# Vivado block design Uart_ETH, xc7z020clg400-1, Vivado 2017.2
# (continued, part 2 of 6)
current_bd_instance /Uart_Blocks/Uart_9
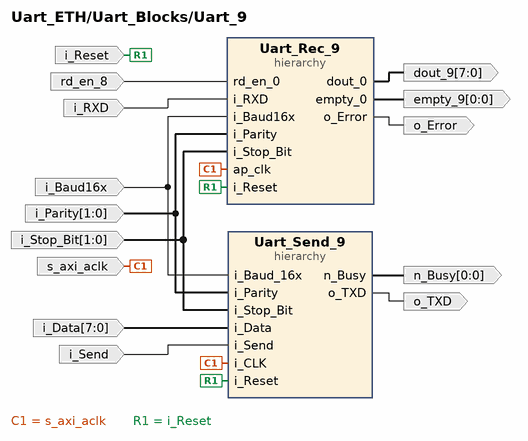
[diagram p24: block diagram inside /Uart_Blocks/Uart_9]
create_bd_pin -dir I -type clk s_axi_aclk
create_bd_pin -dir I i_RXD
create_bd_pin -dir I -type rst i_Reset
create_bd_pin -dir O -from 7 -to 0 dout_9
create_bd_pin -dir O -from 0 -to 0 empty_9
create_bd_pin -dir I rd_en_8
create_bd_pin -dir I -from 7 -to 0 i_Data
create_bd_pin -dir I i_Send
create_bd_pin -dir O -from 0 -to 0 n_Busy
create_bd_pin -dir O o_TXD
create_bd_pin -dir I i_Baud16x
create_bd_pin -dir I -from 1 -to 0 i_Parity
create_bd_pin -dir I -from 1 -to 0 i_Stop_Bit
create_bd_pin -dir O o_Error

create_bd_cell -type hier Uart_Rec_9
create_bd_cell -type hier Uart_Send_9

# ---- hierarchy /Uart_Blocks/Uart_9/Uart_Rec_9 ----
current_bd_instance /Uart_Blocks/Uart_9/Uart_Rec_9
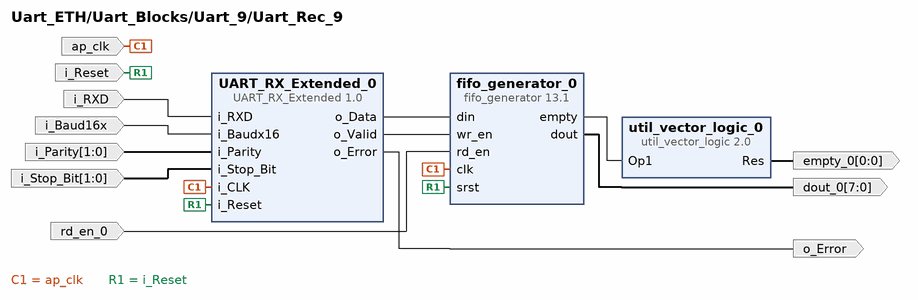
[diagram p25: block diagram inside /Uart_Blocks/Uart_9/Uart_Rec_9]
create_bd_pin -dir I -type clk ap_clk
create_bd_pin -dir I i_RXD
create_bd_pin -dir I -type rst i_Reset
create_bd_pin -dir O -from 7 -to 0 dout_0
create_bd_pin -dir I rd_en_0
create_bd_pin -dir O -from 0 -to 0 empty_0
create_bd_pin -dir I i_Baud16x
create_bd_pin -dir I -from 1 -to 0 i_Parity
create_bd_pin -dir I -from 1 -to 0 i_Stop_Bit
create_bd_pin -dir O o_Error

create_bd_cell -type ip -vlnv xilinx.com:ip:util_vector_logic:2.0 util_vector_logic_0
set_property -dict {CONFIG.C_SIZE 1 CONFIG.C_OPERATION not} [get_bd_cells util_vector_logic_0]
create_bd_cell -type ip -vlnv xilinx.com:ip:fifo_generator:13.1 fifo_generator_0
set_property -dict [list \
  CONFIG.Performance_Options First_Word_Fall_Through \
  CONFIG.Input_Data_Width 8 \
  CONFIG.Input_Depth 256 \
  CONFIG.Output_Data_Width 8 \
  CONFIG.Data_Count true \
  CONFIG.Data_Count_Width 9 \
] [get_bd_cells fifo_generator_0]
create_bd_cell -type ip -vlnv xilinx.com:user:UART_RX_Extended:1.0 UART_RX_Extended_0

# ---- hierarchy /Uart_Blocks/Uart_9/Uart_Send_9 ----
current_bd_instance /Uart_Blocks/Uart_9/Uart_Send_9
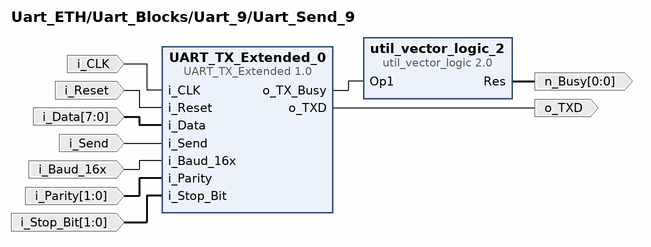
[diagram p26: block diagram inside /Uart_Blocks/Uart_9/Uart_Send_9]
create_bd_pin -dir O -from 0 -to 0 n_Busy
create_bd_pin -dir I -type clk i_CLK
create_bd_pin -dir I -type rst i_Reset
create_bd_pin -dir I -from 7 -to 0 i_Data
create_bd_pin -dir I i_Send
create_bd_pin -dir O o_TXD
create_bd_pin -dir I i_Baud_16x
create_bd_pin -dir I -from 1 -to 0 i_Parity
create_bd_pin -dir I -from 1 -to 0 i_Stop_Bit

create_bd_cell -type ip -vlnv xilinx.com:ip:util_vector_logic:2.0 util_vector_logic_2
set_property -dict {CONFIG.C_SIZE 1 CONFIG.C_OPERATION not} [get_bd_cells util_vector_logic_2]
create_bd_cell -type ip -vlnv xilinx.com:user:UART_TX_Extended:1.0 UART_TX_Extended_0

# ---- hierarchy /Uart_Blocks/Uart_10 ----
current_bd_instance /Uart_Blocks/Uart_10
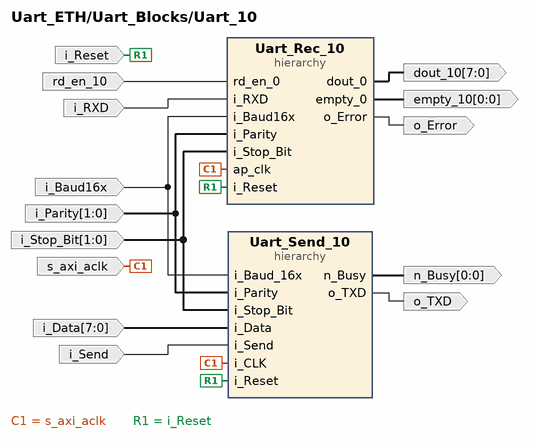
[diagram p27: block diagram inside /Uart_Blocks/Uart_10]
create_bd_pin -dir I -type clk s_axi_aclk
create_bd_pin -dir I i_RXD
create_bd_pin -dir I -type rst i_Reset
create_bd_pin -dir O -from 7 -to 0 dout_10
create_bd_pin -dir O -from 0 -to 0 empty_10
create_bd_pin -dir I rd_en_10
create_bd_pin -dir I -from 7 -to 0 i_Data
create_bd_pin -dir I i_Send
create_bd_pin -dir O -from 0 -to 0 n_Busy
create_bd_pin -dir O o_TXD
create_bd_pin -dir I i_Baud16x
create_bd_pin -dir I -from 1 -to 0 i_Parity
create_bd_pin -dir I -from 1 -to 0 i_Stop_Bit
create_bd_pin -dir O o_Error

create_bd_cell -type hier Uart_Rec_10
create_bd_cell -type hier Uart_Send_10

# ---- hierarchy /Uart_Blocks/Uart_10/Uart_Rec_10 ----
current_bd_instance /Uart_Blocks/Uart_10/Uart_Rec_10
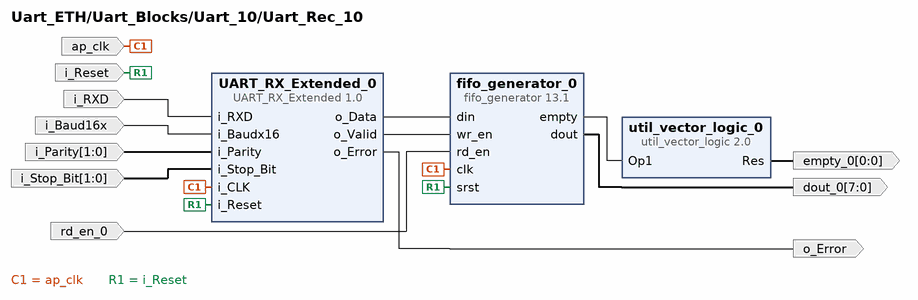
[diagram p28: block diagram inside /Uart_Blocks/Uart_10/Uart_Rec_10]
create_bd_pin -dir I -type clk ap_clk
create_bd_pin -dir I i_RXD
create_bd_pin -dir I -type rst i_Reset
create_bd_pin -dir O -from 7 -to 0 dout_0
create_bd_pin -dir I rd_en_0
create_bd_pin -dir O -from 0 -to 0 empty_0
create_bd_pin -dir I i_Baud16x
create_bd_pin -dir I -from 1 -to 0 i_Parity
create_bd_pin -dir I -from 1 -to 0 i_Stop_Bit
create_bd_pin -dir O o_Error

create_bd_cell -type ip -vlnv xilinx.com:ip:util_vector_logic:2.0 util_vector_logic_0
set_property -dict {CONFIG.C_SIZE 1 CONFIG.C_OPERATION not} [get_bd_cells util_vector_logic_0]
create_bd_cell -type ip -vlnv xilinx.com:ip:fifo_generator:13.1 fifo_generator_0
set_property -dict [list \
  CONFIG.Performance_Options First_Word_Fall_Through \
  CONFIG.Input_Data_Width 8 \
  CONFIG.Input_Depth 256 \
  CONFIG.Output_Data_Width 8 \
  CONFIG.Data_Count true \
  CONFIG.Data_Count_Width 9 \
] [get_bd_cells fifo_generator_0]
create_bd_cell -type ip -vlnv xilinx.com:user:UART_RX_Extended:1.0 UART_RX_Extended_0

# ---- hierarchy /Uart_Blocks/Uart_10/Uart_Send_10 ----
current_bd_instance /Uart_Blocks/Uart_10/Uart_Send_10
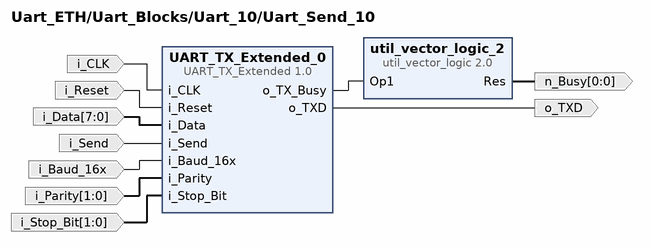
[diagram p29: block diagram inside /Uart_Blocks/Uart_10/Uart_Send_10]
create_bd_pin -dir O -from 0 -to 0 n_Busy
create_bd_pin -dir I -type clk i_CLK
create_bd_pin -dir I -type rst i_Reset
create_bd_pin -dir I -from 7 -to 0 i_Data
create_bd_pin -dir I i_Send
create_bd_pin -dir O o_TXD
create_bd_pin -dir I i_Baud_16x
create_bd_pin -dir I -from 1 -to 0 i_Parity
create_bd_pin -dir I -from 1 -to 0 i_Stop_Bit

create_bd_cell -type ip -vlnv xilinx.com:ip:util_vector_logic:2.0 util_vector_logic_2
set_property -dict {CONFIG.C_SIZE 1 CONFIG.C_OPERATION not} [get_bd_cells util_vector_logic_2]
create_bd_cell -type ip -vlnv xilinx.com:user:UART_TX_Extended:1.0 UART_TX_Extended_0

# ---- hierarchy /Uart_Blocks/Uart_11 ----
current_bd_instance /Uart_Blocks/Uart_11
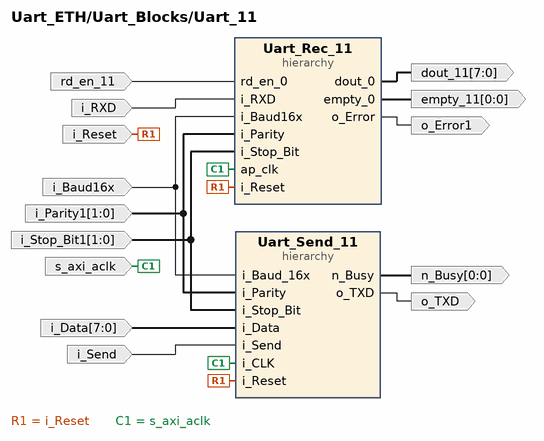
[diagram p30: block diagram inside /Uart_Blocks/Uart_11]
create_bd_pin -dir I i_RXD
create_bd_pin -dir I -type clk s_axi_aclk
create_bd_pin -dir I -type rst i_Reset
create_bd_pin -dir O -from 0 -to 0 empty_11
create_bd_pin -dir I rd_en_11
create_bd_pin -dir I i_Baud16x
create_bd_pin -dir O -from 0 -to 0 n_Busy
create_bd_pin -dir I -from 7 -to 0 i_Data
create_bd_pin -dir O o_TXD
create_bd_pin -dir I i_Send
create_bd_pin -dir O -from 7 -to 0 dout_11
create_bd_pin -dir I -from 1 -to 0 i_Parity1
create_bd_pin -dir I -from 1 -to 0 i_Stop_Bit1
create_bd_pin -dir O o_Error1

create_bd_cell -type hier Uart_Rec_11
create_bd_cell -type hier Uart_Send_11

# ---- hierarchy /Uart_Blocks/Uart_11/Uart_Rec_11 ----
current_bd_instance /Uart_Blocks/Uart_11/Uart_Rec_11
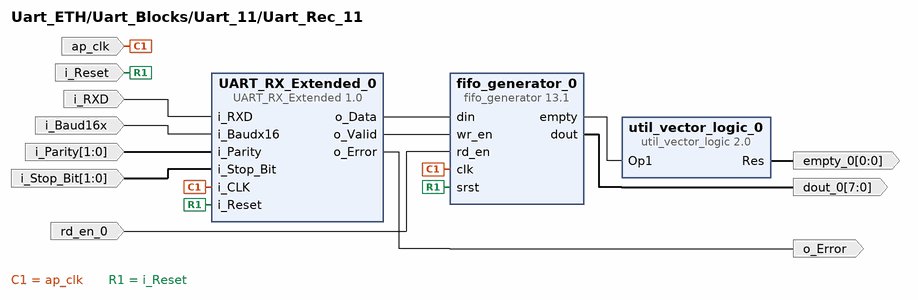
[diagram p31: block diagram inside /Uart_Blocks/Uart_11/Uart_Rec_11]
create_bd_pin -dir I -type clk ap_clk
create_bd_pin -dir I i_RXD
create_bd_pin -dir I -type rst i_Reset
create_bd_pin -dir O -from 7 -to 0 dout_0
create_bd_pin -dir I rd_en_0
create_bd_pin -dir O -from 0 -to 0 empty_0
create_bd_pin -dir I i_Baud16x
create_bd_pin -dir I -from 1 -to 0 i_Parity
create_bd_pin -dir I -from 1 -to 0 i_Stop_Bit
create_bd_pin -dir O o_Error

create_bd_cell -type ip -vlnv xilinx.com:ip:util_vector_logic:2.0 util_vector_logic_0
set_property -dict {CONFIG.C_SIZE 1 CONFIG.C_OPERATION not} [get_bd_cells util_vector_logic_0]
create_bd_cell -type ip -vlnv xilinx.com:ip:fifo_generator:13.1 fifo_generator_0
set_property -dict [list \
  CONFIG.Performance_Options First_Word_Fall_Through \
  CONFIG.Input_Data_Width 8 \
  CONFIG.Input_Depth 256 \
  CONFIG.Output_Data_Width 8 \
  CONFIG.Data_Count true \
  CONFIG.Data_Count_Width 9 \
] [get_bd_cells fifo_generator_0]
create_bd_cell -type ip -vlnv xilinx.com:user:UART_RX_Extended:1.0 UART_RX_Extended_0

# ---- hierarchy /Uart_Blocks/Uart_11/Uart_Send_11 ----
current_bd_instance /Uart_Blocks/Uart_11/Uart_Send_11
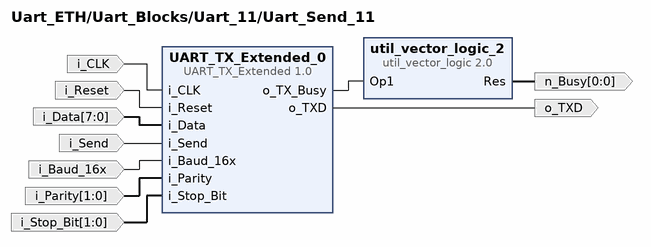
[diagram p32: block diagram inside /Uart_Blocks/Uart_11/Uart_Send_11]
create_bd_pin -dir O -from 0 -to 0 n_Busy
create_bd_pin -dir I -type clk i_CLK
create_bd_pin -dir I -type rst i_Reset
create_bd_pin -dir I -from 7 -to 0 i_Data
create_bd_pin -dir I i_Send
create_bd_pin -dir O o_TXD
create_bd_pin -dir I i_Baud_16x
create_bd_pin -dir I -from 1 -to 0 i_Parity
create_bd_pin -dir I -from 1 -to 0 i_Stop_Bit

create_bd_cell -type ip -vlnv xilinx.com:ip:util_vector_logic:2.0 util_vector_logic_2
set_property -dict {CONFIG.C_SIZE 1 CONFIG.C_OPERATION not} [get_bd_cells util_vector_logic_2]
create_bd_cell -type ip -vlnv xilinx.com:user:UART_TX_Extended:1.0 UART_TX_Extended_0

# ---- hierarchy /Uart_Blocks/Uart_12 ----
current_bd_instance /Uart_Blocks/Uart_12
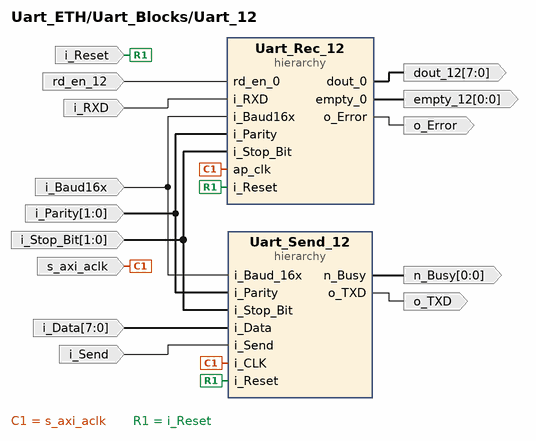
[diagram p33: block diagram inside /Uart_Blocks/Uart_12]
create_bd_pin -dir I -type clk s_axi_aclk
create_bd_pin -dir I i_RXD
create_bd_pin -dir I -type rst i_Reset
create_bd_pin -dir O -from 7 -to 0 dout_12
create_bd_pin -dir O -from 0 -to 0 empty_12
create_bd_pin -dir I rd_en_12
create_bd_pin -dir I -from 7 -to 0 i_Data
create_bd_pin -dir I i_Send
create_bd_pin -dir O -from 0 -to 0 n_Busy
create_bd_pin -dir O o_TXD
create_bd_pin -dir I i_Baud16x
create_bd_pin -dir I -from 1 -to 0 i_Parity
create_bd_pin -dir I -from 1 -to 0 i_Stop_Bit
create_bd_pin -dir O o_Error

create_bd_cell -type hier Uart_Rec_12
create_bd_cell -type hier Uart_Send_12

# ---- hierarchy /Uart_Blocks/Uart_12/Uart_Rec_12 ----
current_bd_instance /Uart_Blocks/Uart_12/Uart_Rec_12
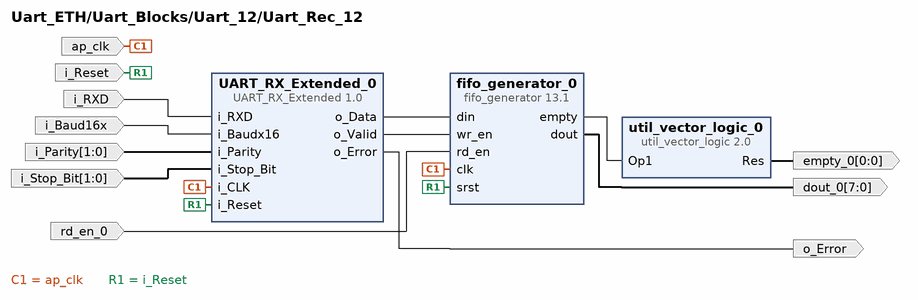
[diagram p34: block diagram inside /Uart_Blocks/Uart_12/Uart_Rec_12]
create_bd_pin -dir I -type clk ap_clk
create_bd_pin -dir I i_RXD
create_bd_pin -dir I -type rst i_Reset
create_bd_pin -dir O -from 7 -to 0 dout_0
create_bd_pin -dir I rd_en_0
create_bd_pin -dir O -from 0 -to 0 empty_0
create_bd_pin -dir I i_Baud16x
create_bd_pin -dir I -from 1 -to 0 i_Parity
create_bd_pin -dir I -from 1 -to 0 i_Stop_Bit
create_bd_pin -dir O o_Error

create_bd_cell -type ip -vlnv xilinx.com:ip:util_vector_logic:2.0 util_vector_logic_0
set_property -dict {CONFIG.C_SIZE 1 CONFIG.C_OPERATION not} [get_bd_cells util_vector_logic_0]
create_bd_cell -type ip -vlnv xilinx.com:ip:fifo_generator:13.1 fifo_generator_0
set_property -dict [list \
  CONFIG.Performance_Options First_Word_Fall_Through \
  CONFIG.Input_Data_Width 8 \
  CONFIG.Input_Depth 256 \
  CONFIG.Output_Data_Width 8 \
  CONFIG.Data_Count true \
  CONFIG.Data_Count_Width 9 \
] [get_bd_cells fifo_generator_0]
create_bd_cell -type ip -vlnv xilinx.com:user:UART_RX_Extended:1.0 UART_RX_Extended_0

# ---- hierarchy /Uart_Blocks/Uart_12/Uart_Send_12 ----
current_bd_instance /Uart_Blocks/Uart_12/Uart_Send_12
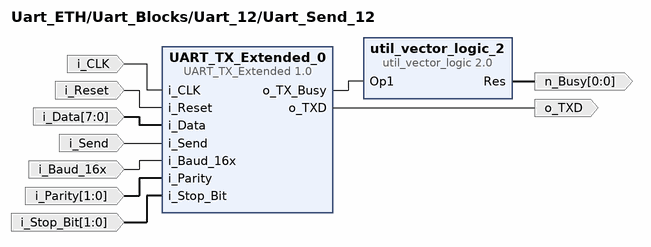
[diagram p35: block diagram inside /Uart_Blocks/Uart_12/Uart_Send_12]
create_bd_pin -dir O -from 0 -to 0 n_Busy
create_bd_pin -dir I -type clk i_CLK
create_bd_pin -dir I -type rst i_Reset
create_bd_pin -dir I -from 7 -to 0 i_Data
create_bd_pin -dir I i_Send
create_bd_pin -dir O o_TXD
create_bd_pin -dir I i_Baud_16x
create_bd_pin -dir I -from 1 -to 0 i_Parity
create_bd_pin -dir I -from 1 -to 0 i_Stop_Bit

create_bd_cell -type ip -vlnv xilinx.com:ip:util_vector_logic:2.0 util_vector_logic_2
set_property -dict {CONFIG.C_SIZE 1 CONFIG.C_OPERATION not} [get_bd_cells util_vector_logic_2]
create_bd_cell -type ip -vlnv xilinx.com:user:UART_TX_Extended:1.0 UART_TX_Extended_0

# ---- hierarchy /Uart_Blocks/Uart_13 ----
current_bd_instance /Uart_Blocks/Uart_13
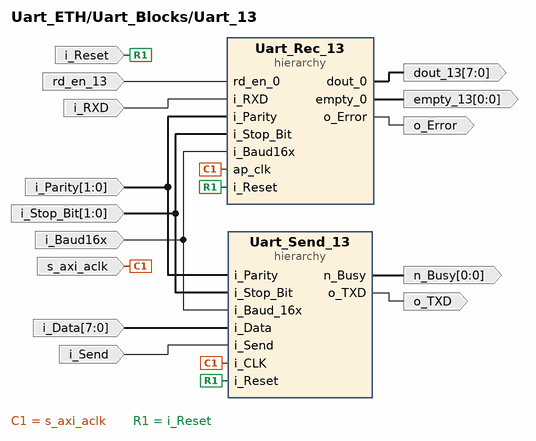
[diagram p36: block diagram inside /Uart_Blocks/Uart_13]
create_bd_pin -dir I -type clk s_axi_aclk
create_bd_pin -dir I i_RXD
create_bd_pin -dir I -type rst i_Reset
create_bd_pin -dir O -from 7 -to 0 dout_13
create_bd_pin -dir O -from 0 -to 0 empty_13
create_bd_pin -dir I rd_en_13
create_bd_pin -dir I -from 7 -to 0 i_Data
create_bd_pin -dir I i_Send
create_bd_pin -dir O -from 0 -to 0 n_Busy
create_bd_pin -dir O o_TXD
create_bd_pin -dir I i_Baud16x
create_bd_pin -dir I -from 1 -to 0 i_Parity
create_bd_pin -dir I -from 1 -to 0 i_Stop_Bit
create_bd_pin -dir O o_Error

create_bd_cell -type hier Uart_Rec_13
create_bd_cell -type hier Uart_Send_13

# ---- hierarchy /Uart_Blocks/Uart_13/Uart_Rec_13 ----
current_bd_instance /Uart_Blocks/Uart_13/Uart_Rec_13
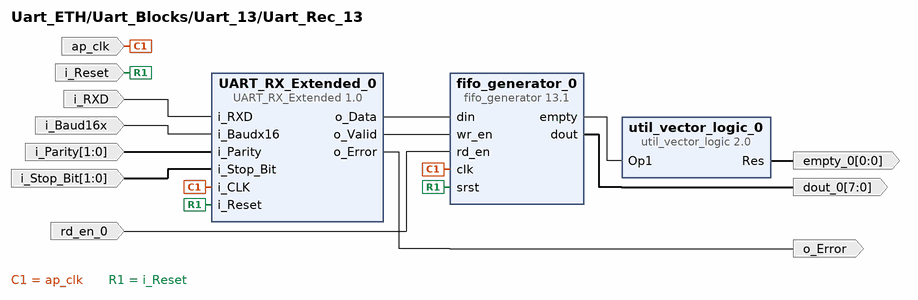
[diagram p37: block diagram inside /Uart_Blocks/Uart_13/Uart_Rec_13]
create_bd_pin -dir I -type clk ap_clk
create_bd_pin -dir I i_RXD
create_bd_pin -dir I -type rst i_Reset
create_bd_pin -dir O -from 7 -to 0 dout_0
create_bd_pin -dir I rd_en_0
create_bd_pin -dir O -from 0 -to 0 empty_0
create_bd_pin -dir I i_Baud16x
create_bd_pin -dir I -from 1 -to 0 i_Parity
create_bd_pin -dir I -from 1 -to 0 i_Stop_Bit
create_bd_pin -dir O o_Error

create_bd_cell -type ip -vlnv xilinx.com:ip:util_vector_logic:2.0 util_vector_logic_0
set_property -dict {CONFIG.C_SIZE 1 CONFIG.C_OPERATION not} [get_bd_cells util_vector_logic_0]
create_bd_cell -type ip -vlnv xilinx.com:ip:fifo_generator:13.1 fifo_generator_0
set_property -dict [list \
  CONFIG.Performance_Options First_Word_Fall_Through \
  CONFIG.Input_Data_Width 8 \
  CONFIG.Input_Depth 256 \
  CONFIG.Output_Data_Width 8 \
  CONFIG.Data_Count true \
  CONFIG.Data_Count_Width 9 \
] [get_bd_cells fifo_generator_0]
create_bd_cell -type ip -vlnv xilinx.com:user:UART_RX_Extended:1.0 UART_RX_Extended_0

# ---- hierarchy /Uart_Blocks/Uart_13/Uart_Send_13 ----
current_bd_instance /Uart_Blocks/Uart_13/Uart_Send_13
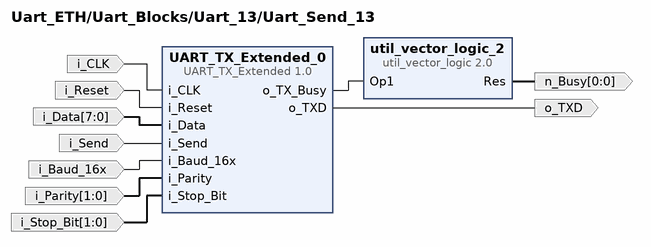
[diagram p38: block diagram inside /Uart_Blocks/Uart_13/Uart_Send_13]
create_bd_pin -dir O -from 0 -to 0 n_Busy
create_bd_pin -dir I -type clk i_CLK
create_bd_pin -dir I -type rst i_Reset
create_bd_pin -dir I -from 7 -to 0 i_Data
create_bd_pin -dir I i_Send
create_bd_pin -dir O o_TXD
create_bd_pin -dir I i_Baud_16x
create_bd_pin -dir I -from 1 -to 0 i_Parity
create_bd_pin -dir I -from 1 -to 0 i_Stop_Bit

create_bd_cell -type ip -vlnv xilinx.com:ip:util_vector_logic:2.0 util_vector_logic_2
set_property -dict {CONFIG.C_SIZE 1 CONFIG.C_OPERATION not} [get_bd_cells util_vector_logic_2]
create_bd_cell -type ip -vlnv xilinx.com:user:UART_TX_Extended:1.0 UART_TX_Extended_0

# ---- hierarchy /Uart_Blocks/Uart_14 ----
current_bd_instance /Uart_Blocks/Uart_14
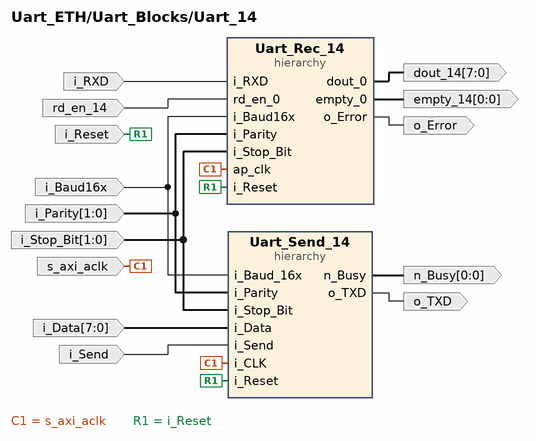
[diagram p39: block diagram inside /Uart_Blocks/Uart_14]
create_bd_pin -dir I -type clk s_axi_aclk
create_bd_pin -dir I i_RXD
create_bd_pin -dir I -type rst i_Reset
create_bd_pin -dir O -from 7 -to 0 dout_14
create_bd_pin -dir O -from 0 -to 0 empty_14
create_bd_pin -dir I rd_en_14
create_bd_pin -dir I -from 7 -to 0 i_Data
create_bd_pin -dir I i_Send
create_bd_pin -dir O -from 0 -to 0 n_Busy
create_bd_pin -dir O o_TXD
create_bd_pin -dir I i_Baud16x
create_bd_pin -dir I -from 1 -to 0 i_Parity
create_bd_pin -dir I -from 1 -to 0 i_Stop_Bit
create_bd_pin -dir O o_Error

create_bd_cell -type hier Uart_Rec_14
create_bd_cell -type hier Uart_Send_14

# ---- hierarchy /Uart_Blocks/Uart_14/Uart_Rec_14 ----
current_bd_instance /Uart_Blocks/Uart_14/Uart_Rec_14
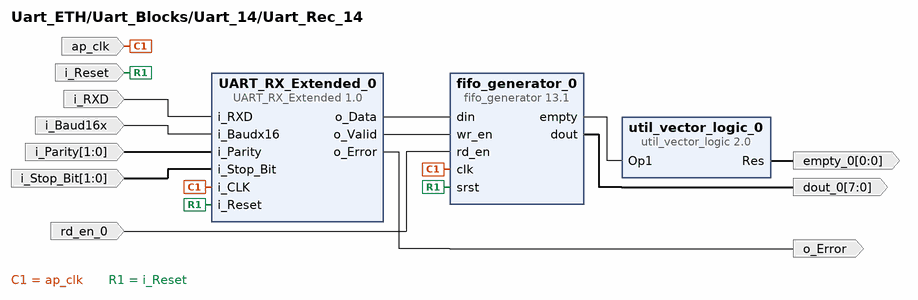
[diagram p40: block diagram inside /Uart_Blocks/Uart_14/Uart_Rec_14]
create_bd_pin -dir I -type clk ap_clk
create_bd_pin -dir I i_RXD
create_bd_pin -dir I -type rst i_Reset
create_bd_pin -dir O -from 7 -to 0 dout_0
create_bd_pin -dir I rd_en_0
create_bd_pin -dir O -from 0 -to 0 empty_0
create_bd_pin -dir I i_Baud16x
create_bd_pin -dir I -from 1 -to 0 i_Parity
create_bd_pin -dir I -from 1 -to 0 i_Stop_Bit
create_bd_pin -dir O o_Error

create_bd_cell -type ip -vlnv xilinx.com:ip:util_vector_logic:2.0 util_vector_logic_0
set_property -dict {CONFIG.C_SIZE 1 CONFIG.C_OPERATION not} [get_bd_cells util_vector_logic_0]
create_bd_cell -type ip -vlnv xilinx.com:ip:fifo_generator:13.1 fifo_generator_0
set_property -dict [list \
  CONFIG.Performance_Options First_Word_Fall_Through \
  CONFIG.Input_Data_Width 8 \
  CONFIG.Input_Depth 256 \
  CONFIG.Output_Data_Width 8 \
  CONFIG.Data_Count true \
  CONFIG.Data_Count_Width 9 \
] [get_bd_cells fifo_generator_0]
create_bd_cell -type ip -vlnv xilinx.com:user:UART_RX_Extended:1.0 UART_RX_Extended_0

# ---- hierarchy /Uart_Blocks/Uart_14/Uart_Send_14 ----
current_bd_instance /Uart_Blocks/Uart_14/Uart_Send_14
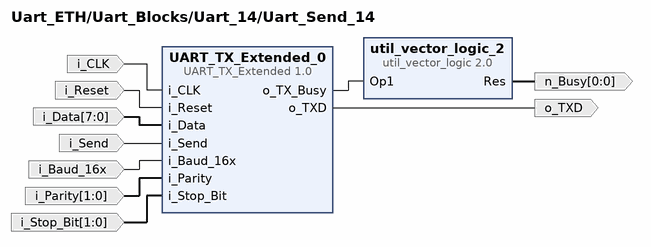
[diagram p41: block diagram inside /Uart_Blocks/Uart_14/Uart_Send_14]
create_bd_pin -dir O -from 0 -to 0 n_Busy
create_bd_pin -dir I -type clk i_CLK
create_bd_pin -dir I -type rst i_Reset
create_bd_pin -dir I -from 7 -to 0 i_Data
create_bd_pin -dir I i_Send
create_bd_pin -dir O o_TXD
create_bd_pin -dir I i_Baud_16x
create_bd_pin -dir I -from 1 -to 0 i_Parity
create_bd_pin -dir I -from 1 -to 0 i_Stop_Bit

create_bd_cell -type ip -vlnv xilinx.com:ip:util_vector_logic:2.0 util_vector_logic_2
set_property -dict {CONFIG.C_SIZE 1 CONFIG.C_OPERATION not} [get_bd_cells util_vector_logic_2]
create_bd_cell -type ip -vlnv xilinx.com:user:UART_TX_Extended:1.0 UART_TX_Extended_0

# ---- hierarchy /Uart_Blocks/Uart_15 ----
current_bd_instance /Uart_Blocks/Uart_15
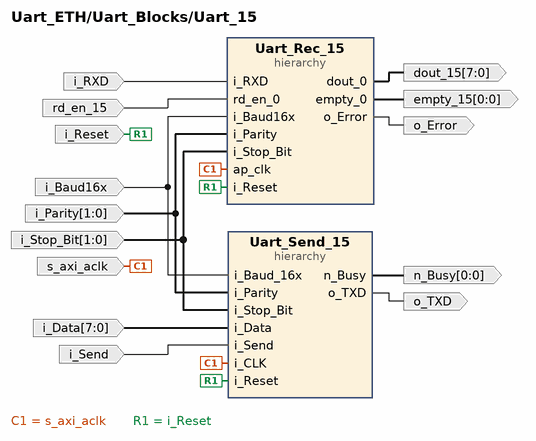
[diagram p42: block diagram inside /Uart_Blocks/Uart_15]
create_bd_pin -dir I -type clk s_axi_aclk
create_bd_pin -dir I i_RXD
create_bd_pin -dir I -type rst i_Reset
create_bd_pin -dir O -from 7 -to 0 dout_15
create_bd_pin -dir O -from 0 -to 0 empty_15
create_bd_pin -dir I rd_en_15
create_bd_pin -dir I -from 7 -to 0 i_Data
create_bd_pin -dir I i_Send
create_bd_pin -dir O -from 0 -to 0 n_Busy
create_bd_pin -dir O o_TXD
create_bd_pin -dir I i_Baud16x
create_bd_pin -dir I -from 1 -to 0 i_Parity
create_bd_pin -dir I -from 1 -to 0 i_Stop_Bit
create_bd_pin -dir O o_Error

create_bd_cell -type hier Uart_Rec_15
create_bd_cell -type hier Uart_Send_15

# ---- hierarchy /Uart_Blocks/Uart_15/Uart_Rec_15 ----
current_bd_instance /Uart_Blocks/Uart_15/Uart_Rec_15
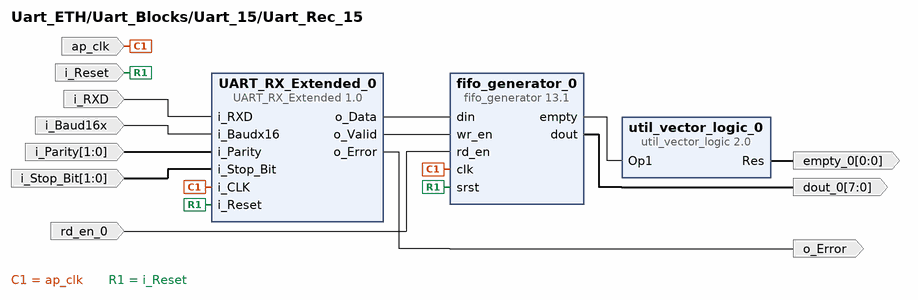
[diagram p43: block diagram inside /Uart_Blocks/Uart_15/Uart_Rec_15]
create_bd_pin -dir I -type clk ap_clk
create_bd_pin -dir I i_RXD
create_bd_pin -dir I -type rst i_Reset
create_bd_pin -dir O -from 7 -to 0 dout_0
create_bd_pin -dir I rd_en_0
create_bd_pin -dir O -from 0 -to 0 empty_0
create_bd_pin -dir I i_Baud16x
create_bd_pin -dir I -from 1 -to 0 i_Parity
create_bd_pin -dir I -from 1 -to 0 i_Stop_Bit
create_bd_pin -dir O o_Error

create_bd_cell -type ip -vlnv xilinx.com:ip:util_vector_logic:2.0 util_vector_logic_0
set_property -dict {CONFIG.C_SIZE 1 CONFIG.C_OPERATION not} [get_bd_cells util_vector_logic_0]
create_bd_cell -type ip -vlnv xilinx.com:ip:fifo_generator:13.1 fifo_generator_0
set_property -dict [list \
  CONFIG.Performance_Options First_Word_Fall_Through \
  CONFIG.Input_Data_Width 8 \
  CONFIG.Input_Depth 256 \
  CONFIG.Output_Data_Width 8 \
  CONFIG.Data_Count true \
  CONFIG.Data_Count_Width 9 \
] [get_bd_cells fifo_generator_0]
create_bd_cell -type ip -vlnv xilinx.com:user:UART_RX_Extended:1.0 UART_RX_Extended_0

# ---- hierarchy /Uart_Blocks/Uart_15/Uart_Send_15 ----
current_bd_instance /Uart_Blocks/Uart_15/Uart_Send_15
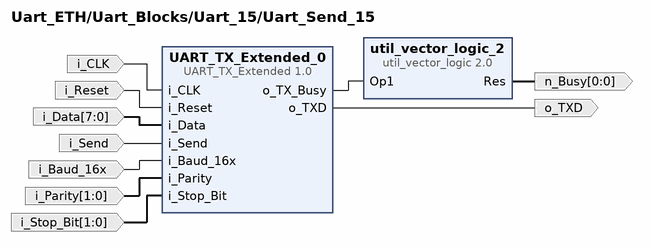
[diagram p44: block diagram inside /Uart_Blocks/Uart_15/Uart_Send_15]
create_bd_pin -dir O -from 0 -to 0 n_Busy
create_bd_pin -dir I -type clk i_CLK
create_bd_pin -dir I -type rst i_Reset
create_bd_pin -dir I -from 7 -to 0 i_Data
create_bd_pin -dir I i_Send
create_bd_pin -dir O o_TXD
create_bd_pin -dir I i_Baud_16x
create_bd_pin -dir I -from 1 -to 0 i_Parity
create_bd_pin -dir I -from 1 -to 0 i_Stop_Bit

create_bd_cell -type ip -vlnv xilinx.com:ip:util_vector_logic:2.0 util_vector_logic_2
set_property -dict {CONFIG.C_SIZE 1 CONFIG.C_OPERATION not} [get_bd_cells util_vector_logic_2]
create_bd_cell -type ip -vlnv xilinx.com:user:UART_TX_Extended:1.0 UART_TX_Extended_0

# ---- hierarchy /Uart_Blocks/Uart_0 ----
current_bd_instance /Uart_Blocks/Uart_0
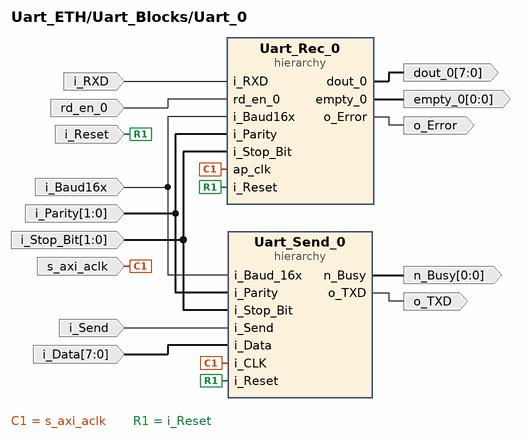
[diagram p45: block diagram inside /Uart_Blocks/Uart_0]
create_bd_pin -dir I -type clk s_axi_aclk
create_bd_pin -dir I i_RXD
create_bd_pin -dir I -type rst i_Reset
create_bd_pin -dir O -from 7 -to 0 dout_0
create_bd_pin -dir I rd_en_0
create_bd_pin -dir O -from 0 -to 0 empty_0
create_bd_pin -dir I i_Send
create_bd_pin -dir O -from 0 -to 0 n_Busy
create_bd_pin -dir I -from 7 -to 0 i_Data
create_bd_pin -dir O o_TXD
create_bd_pin -dir I i_Baud16x
create_bd_pin -dir I -from 1 -to 0 i_Parity
create_bd_pin -dir I -from 1 -to 0 i_Stop_Bit
create_bd_pin -dir O o_Error

create_bd_cell -type hier Uart_Rec_0
create_bd_cell -type hier Uart_Send_0

# ---- hierarchy /Uart_Blocks/Uart_0/Uart_Rec_0 ----
current_bd_instance /Uart_Blocks/Uart_0/Uart_Rec_0
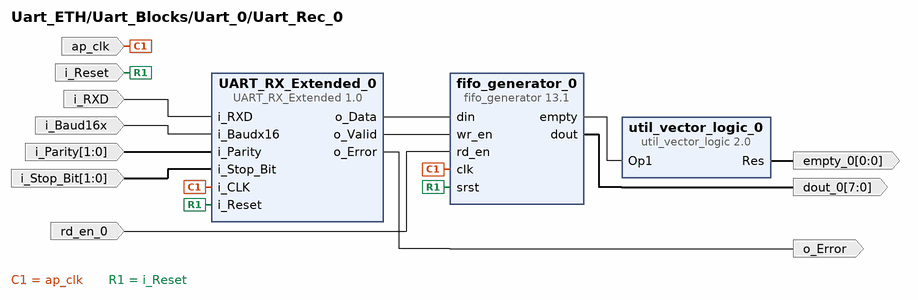
[diagram p46: block diagram inside /Uart_Blocks/Uart_0/Uart_Rec_0]
create_bd_pin -dir I -type clk ap_clk
create_bd_pin -dir I i_RXD
create_bd_pin -dir I -type rst i_Reset
create_bd_pin -dir O -from 7 -to 0 dout_0
create_bd_pin -dir I rd_en_0
create_bd_pin -dir O -from 0 -to 0 empty_0
create_bd_pin -dir I i_Baud16x
create_bd_pin -dir I -from 1 -to 0 i_Parity
create_bd_pin -dir I -from 1 -to 0 i_Stop_Bit
create_bd_pin -dir O o_Error

create_bd_cell -type ip -vlnv xilinx.com:ip:util_vector_logic:2.0 util_vector_logic_0
set_property -dict {CONFIG.C_SIZE 1 CONFIG.C_OPERATION not} [get_bd_cells util_vector_logic_0]
create_bd_cell -type ip -vlnv xilinx.com:ip:fifo_generator:13.1 fifo_generator_0
set_property -dict [list \
  CONFIG.Performance_Options First_Word_Fall_Through \
  CONFIG.Input_Data_Width 8 \
  CONFIG.Input_Depth 256 \
  CONFIG.Output_Data_Width 8 \
  CONFIG.Data_Count true \
  CONFIG.Data_Count_Width 9 \
] [get_bd_cells fifo_generator_0]
create_bd_cell -type ip -vlnv xilinx.com:user:UART_RX_Extended:1.0 UART_RX_Extended_0

# ---- hierarchy /Uart_Blocks/Uart_0/Uart_Send_0 ----
current_bd_instance /Uart_Blocks/Uart_0/Uart_Send_0
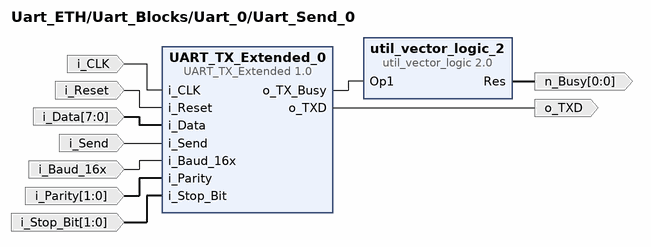
[diagram p47: block diagram inside /Uart_Blocks/Uart_0/Uart_Send_0]
create_bd_pin -dir O -from 0 -to 0 n_Busy
create_bd_pin -dir I -type clk i_CLK
create_bd_pin -dir I -type rst i_Reset
create_bd_pin -dir I -from 7 -to 0 i_Data
create_bd_pin -dir I i_Send
create_bd_pin -dir O o_TXD
create_bd_pin -dir I i_Baud_16x
create_bd_pin -dir I -from 1 -to 0 i_Parity
create_bd_pin -dir I -from 1 -to 0 i_Stop_Bit

create_bd_cell -type ip -vlnv xilinx.com:ip:util_vector_logic:2.0 util_vector_logic_2
set_property -dict {CONFIG.C_SIZE 1 CONFIG.C_OPERATION not} [get_bd_cells util_vector_logic_2]
create_bd_cell -type ip -vlnv xilinx.com:user:UART_TX_Extended:1.0 UART_TX_Extended_0

# ---- hierarchy /Uart_Blocks/Uart_1 ----
current_bd_instance /Uart_Blocks/Uart_1
